# EAGLE schematic adapter (EAGLE 6.4)
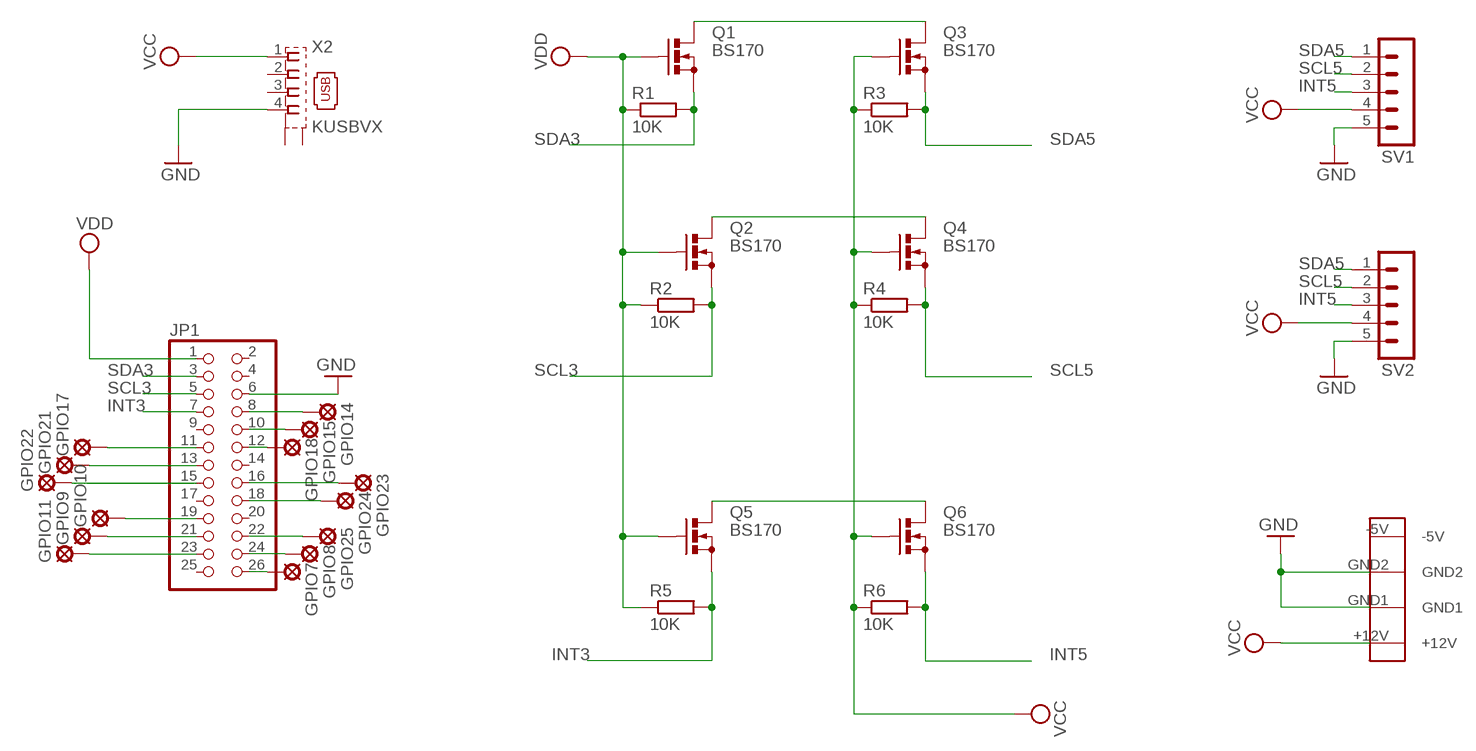
[diagram p0: schematic, sheet 1]

## Parts
GPIO7  LSP10  [LSP10]
GPIO8  LSP10  [LSP10]
GPIO9  LSP10  [LSP10]
GPIO10  LSP10  [LSP10]
GPIO11  LSP10  [LSP10]
GPIO14  LSP10  [LSP10]
GPIO15  LSP10  [LSP10]
GPIO17  GPIO17  LSP10  [LSP10]
GPIO18  LSP10  [LSP10]
GPIO21  LSP10  [LSP10]
GPIO22  LSP10  [LSP10]
GPIO23  LSP10  [LSP10]
GPIO24  LSP10  [LSP10]
GPIO25  LSP10  [LSP10]
JP1  PINHD-2X13  [2X13]
Q1  BS170  [SOT54E]
Q2  BS170  [SOT54E]
Q3  BS170  [SOT54E]
Q4  BS170  [SOT54E]
Q5  BS170  [SOT54E]
Q6  BS170  [SOT54E]
R1  10K  R-EU_0207/2V  [0207/2V]
R2  10K  R-EU_0207/2V  [0207/2V]
R3  10K  R-EU_0207/2V  [0207/2V]
R4  10K  R-EU_0207/2V  [0207/2V]
R5  10K  R-EU_0207/2V  [0207/2V]
R6  10K  R-EU_0207/2V  [0207/2V]
SV1  MA05-1  [MA05-1]
SV2  MA05-1  [MA05-1]
U$1  PSW_5  [PSW_5]
X2  KUSBVX  [KUSBVX]

## Nets
GND: JP1.6 SV1.5 SV2.5 U$1.GND1 U$1.GND2 X2.4
INT3: JP1.7 Q5.S R5.2
INT5: Q6.S R6.2 SV1.3 SV2.3
N$1: GPIO17.MP JP1.11
N$2: GPIO21.MP JP1.13
N$3: GPIO22.MP JP1.15
N$4: GPIO10.MP JP1.19
N$5: GPIO9.MP JP1.21
N$6: GPIO11.MP JP1.23
N$7: GPIO14.MP JP1.8
N$8: GPIO15.MP JP1.10
N$9: GPIO18.MP JP1.12
N$10: GPIO23.MP JP1.16
N$11: GPIO24.MP JP1.18
N$12: GPIO25.MP JP1.22
N$13: GPIO8.MP JP1.24
N$14: GPIO7.MP JP1.26
N$15: Q1.D Q3.D
N$16: Q2.D Q4.D
N$17: Q5.D Q6.D
SCL3: JP1.5 Q2.S R2.2
SCL5: Q4.S R4.2 SV1.2 SV2.2
SDA3: JP1.3 Q1.S R1.2
SDA5: Q3.S R3.2 SV1.1 SV2.1
VCC: Q3.G Q4.G Q6.G R3.1 R4.1 R6.1 SV1.4 SV2.4 U$1.+12V X2.1
VDD: JP1.1 Q1.G Q2.G Q5.G R1.1 R2.1 R5.1
Unconnected: JP1.2 JP1.4 JP1.9 JP1.14 JP1.17 JP1.20 JP1.25 U$1.-5V X2.2 X2.3 X2.M1(S1) X2.M2(S2)

## Library data of the parts
GPIO7-GPIO11 GPIO14 GPIO15 GPIO17 GPIO18 GPIO21-GPIO25 = solpad:LSP10: SOLDER PAD drill 1.0 mm, distributor Buerklin, 12H555
JP1 = pinhead:PINHD-2X13: PIN HEADER
Q1-Q6 = transistor-small-signal:BS170: N-CHANNEL MOS FET
R1-R6 = resistor:R-EU_: RESISTOR, European symbol
SV1 SV2 = con-lstb:MA05-1: PIN HEADER; OC_FARNELL: unknown; OC_NEWARK: unknown
U$1 = n39:PSW_5: PSW 5 Stromversorgungsstecker f. 5 1/4 Zoll, Print, gew. http://www.reichelt.de/Floppy-Powerstecker/PSW-5/3/index.html?;ACTION=3;LA=446;ARTICLE=14915;GROUPID=3257;artnr=PSW+5;SID=11UOMKs38AAAIAABbvFEc5b11be4da1ac9cc045b827e422a49e7b
X2 = con-kycon:KUSBVX: Vertical,Top Entry Universal Serial Bus Connector KUSBVX Series Source: KYCON Sibalco USB vertical socket KUSBV.pdf